# Altium schematic sheet VariablePWMDriverSchematic.SchDoc
size A4
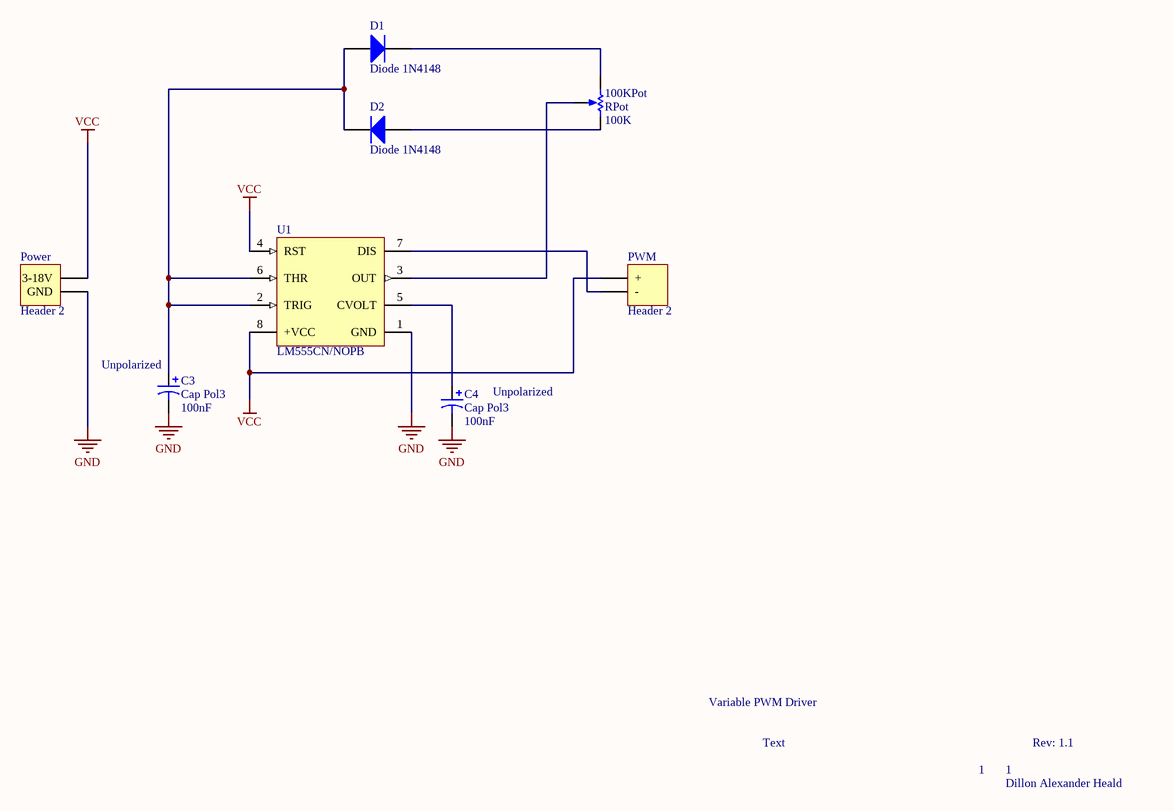
[diagram p0: VariablePWMDriverSchematic.SchDoc]

## Parts
100KPot  RPot  value 100K  [VR5]
C3  Cap Pol3  value 100nF  [C0805]
C4  Cap Pol3  value 100nF  [C0805]
D1  Diode 1N4148  [DO-35]
D2  Diode 1N4148  [DO-35]
Power  Header 2  [HDR1X2]
PWM  Header 2  [HDR1X2]
U1  LM555CN/NOPB  [N08E]

## Nets
GND: C3.2 C4.2 Power.2(GND) U1.1(GND)
VCC: Power.1(3-18V) PWM.1(+) U1.4(RST) U1.8(+VCC)
Net100KPot_1: 100KPot.1(TOP) D1.2(K)
Net100KPot_2: 100KPot.2(BOT) D2.1(A)
Net100KPot_3: 100KPot.3(TAP) U1.3(OUT)
NetC3_1: C3.1 D1.1(A) D2.2(K) U1.2(TRIG) U1.6(THR)
NetC4_1: C4.1 U1.5(CVOLT)
NetPWM_2: PWM.2(-) U1.7(DIS)

## Notes on the sheet
- (near C3) Unpolarized
- (near C4) Unpolarized
- Variable PWM Driver
- Text
- 1
- Rev: 1.1
- Dillon Alexander Heald

## Library data of the parts
100KPot = RPot: Potentiometer; Sim Note: Enter the Resistance value and the set point into parameter fields.; Set Position: 0.5; Published: 8-Jun-2000; LatestRevisionDate: 17-Jul-2002; LatestRevisionNote: Re-released for DXP Platform.; PackageReference: VR5; Publisher: Altium Limited; PackageDescription: Variable Resistor, Thru-Hole; 3 Leads
C3 C4 = Cap Pol3: Polarized Capacitor (Surface Mount); Published: 8-Jun-2000; LatestRevisionDate: 29-May-2009; LatestRevisionNote: IPC-7351 Footprint Added.; PackageReference: C0805; Publisher: Altium Limited; PackageDescription: Chip Capacitor
D1 D2 = Diode 1N4148: High Conductance Fast Diode; Published: 8-Jun-2000; LatestRevisionDate: 17-Jul-2002; LatestRevisionNote: Re-released for DXP Platform.; DatasheetVersion: 1997; PackageReference: DO-35; Publisher: Altium Limited; PackageDescription: Diode, Axial; Body 3.8 x 1.9 mm (LxDia. max), Lead Dia. 0.53 mm (max); Code_JEDEC: DO-204-AH; ComponentLink1Description: Manufacturer Link; ComponentLink1URL: http://www.fairchildsemi.com/; ComponentLink2Description: Datasheet; ComponentLink2URL: http://www.fairchildsemi.com/ds/1N%2F1N4148.pdf
Power PWM = Header 2: Header, 2-Pin; LatestRevisionDate: 17-Jul-2002; LatestRevisionNote: Re-released for DXP Platform.; Publisher: Altium Limited
U1 = CMP-0056-00016-2: Timer, 8-pin MDIP, Pb-Free; Manufacturer: National Semiconductor; CompType: Analog IC; PowerWise: N; PackageTopMarking: NSUZXYTTE#*LM*555CN; ComponentLink3Description: N08E Package Page; ComponentLink3URL: http://www.national.com/packaging/folders/n08e.html; ComponentLink1URL: http://www.national.com/ds/LM/LM555.pdf; PackageVersion: revG, May-2006; PackageDescription: MDIP, .365 x .250 x .130in, 8 Lead, .100in Pitch; ComponentLink1Description: LM555 Datasheet; RevisionNote: Component URLs added; ComponentLink2URL: http://www.national.com/pf/LM/LM555.html; RoHS: Y; Code_JEDEC: MS-001-BA; DatasheetVersion: Jul-2006; PackageReference: N08E; PinCount: 8; ComponentLink2Description: LM555 Web Page